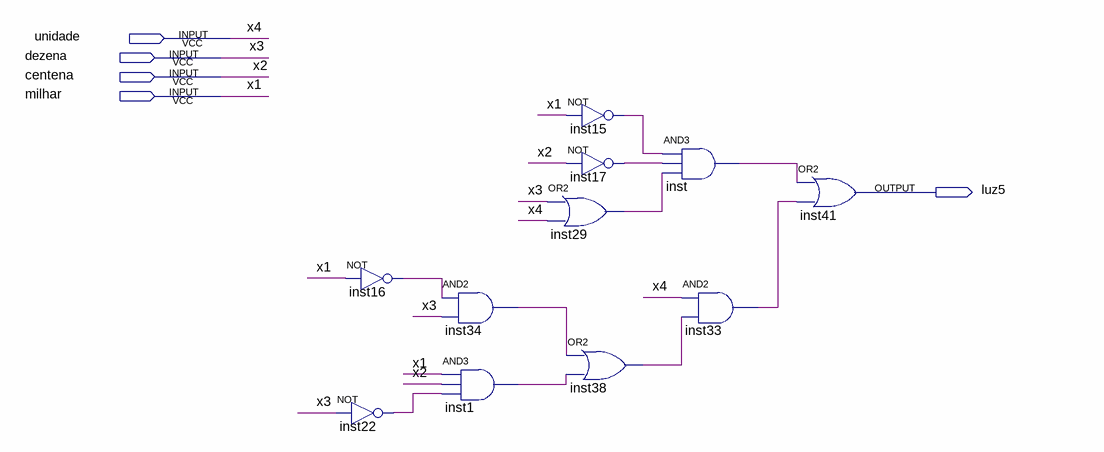
[diagram p0: schematic sheet]
// Quartus schematic luz5.bdf as structural Verilog: 11 symbols, 5 pins
module luz5 (
  input  unidade,
  input  dezena,
  input  centena,
  input  milhar,
  output luz5
);

  wire inst1_out, inst15_out, inst16_out, inst17_out, inst22_out, inst29_out, inst33_out, inst34_out,
       inst38_out, inst_out;

  not inst16 (inst16_out, milhar);
  not inst22 (inst22_out, dezena);
  and inst34 (inst34_out, inst16_out, dezena);
  and inst1 (inst1_out, milhar, centena, inst22_out);
  not inst15 (inst15_out, milhar);
  not inst17 (inst17_out, centena);
  or inst29 (inst29_out, dezena, unidade);
  or inst38 (inst38_out, inst34_out, inst1_out);
  and inst (inst_out, inst15_out, inst17_out, inst29_out);
  and inst33 (inst33_out, unidade, inst38_out);
  or inst41 (luz5, inst_out, inst33_out);

  // Other names for the same wires on the sheet: x1 = milhar; x2 = centena; x3 = dezena; x4 = unidade
endmodule
